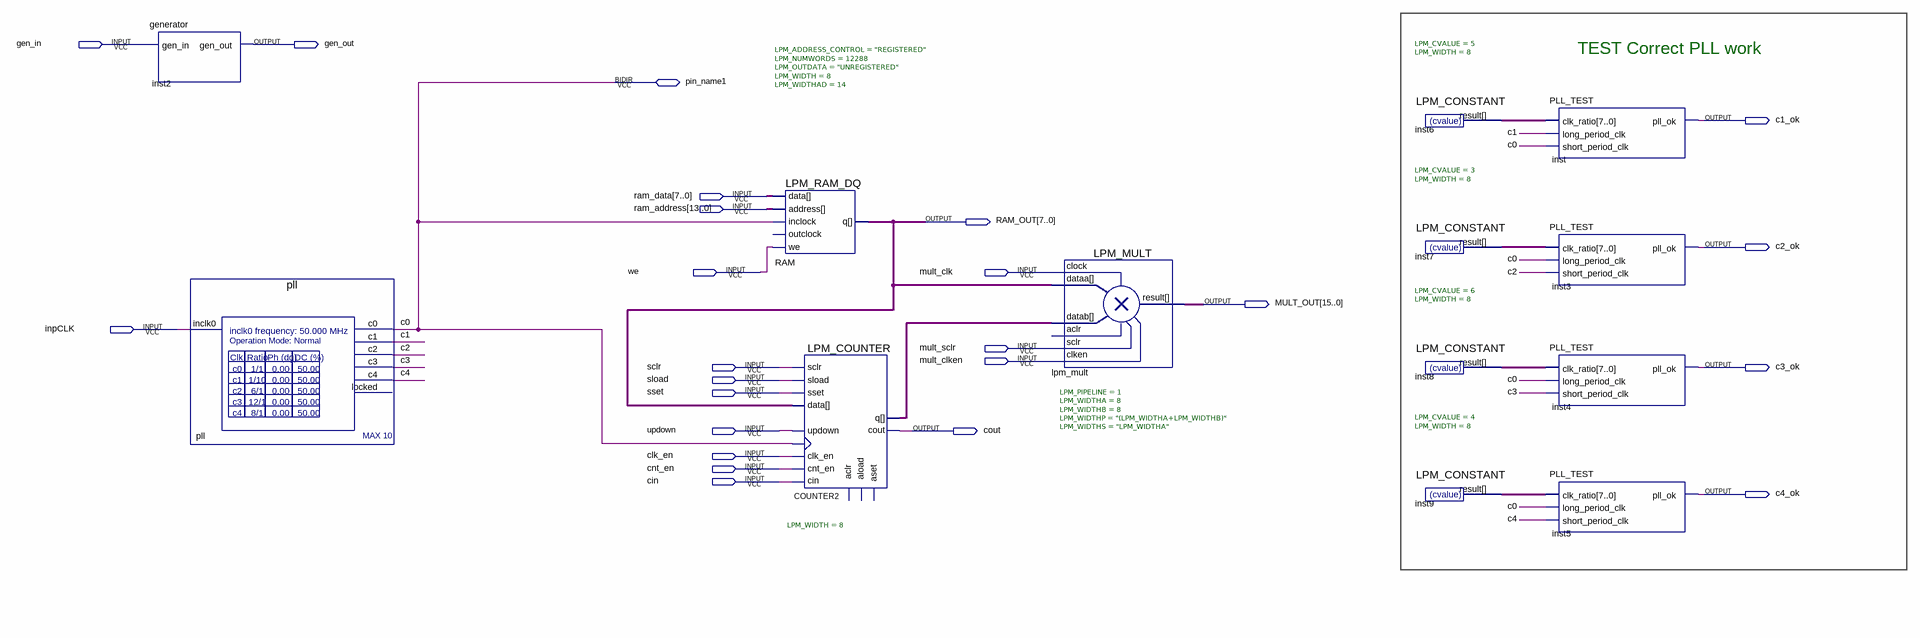
[diagram p0: schematic sheet]
// Quartus schematic main.bdf as structural Verilog: 13 symbols, 24 pins
module main (
  input  gen_in,
  input  [7:0] ram_data,
  input  [13:0] ram_address,
  input  we,
  input  mult_clk,
  input  inpCLK,
  input  mult_sclr,
  input  mult_clken,
  input  sclr,
  input  sload,
  input  sset,
  input  updown,
  input  clk_en,
  input  cnt_en,
  input  cin,
  inout  pin_name1,
  output gen_out,
  output c1_ok,
  output [7:0] RAM_OUT,
  output c2_ok,
  output [15:0] MULT_OUT,
  output c3_ok,
  output cout,
  output c4_ok
);

  wire c1, c2, c3, c4;
  wire [7:0] COUNTER2_q, inst6_result, inst7_result, inst8_result, inst9_result;

  generator inst2 (.gen_in(gen_in), .gen_out(gen_out));
  pll pll (.inclk0(inpCLK), .c0(pin_name1), .c1(c1), .c2(c2), .c3(c3), .c4(c4));  // open: locked
  LPM_RAM_DQ #(.LPM_ADDRESS_CONTROL("REGISTERED"), .LPM_NUMWORDS(12288), .LPM_OUTDATA("UNREGISTERED"), .LPM_WIDTH(8), .LPM_WIDTHAD(14)) RAM (
    .inclock(pin_name1), .data(ram_data), .address(ram_address), .we(we), .q(RAM_OUT));  // open: outclock
  LPM_COUNTER #(.LPM_WIDTH(8)) COUNTER2 (
    .sload(sload), .data(RAM_OUT), .clock(pin_name1), .clk_en(clk_en), .cin(cin), .sset(sset),
    .updown(updown), .cnt_en(cnt_en), .sclr(sclr), .q(COUNTER2_q), .cout(cout));  // open: aload, aclr, aset
  LPM_MULT #(.LPM_PIPELINE(1), .LPM_WIDTHA(8), .LPM_WIDTHB(8), .LPM_WIDTHP("(LPM_WIDTHA+LPM_WIDTHB)"), .LPM_WIDTHS("LPM_WIDTHA")) lpm_mult (
    .clock(mult_clk), .dataa(RAM_OUT), .datab(COUNTER2_q), .sclr(mult_sclr), .clken(mult_clken),
    .result(MULT_OUT));  // open: aclr
  LPM_CONSTANT #(.LPM_CVALUE(5), .LPM_WIDTH(8)) inst6 (.result(inst6_result));
  LPM_CONSTANT #(.LPM_CVALUE(3), .LPM_WIDTH(8)) inst7 (.result(inst7_result));
  LPM_CONSTANT #(.LPM_CVALUE(6), .LPM_WIDTH(8)) inst8 (.result(inst8_result));
  LPM_CONSTANT #(.LPM_CVALUE(4), .LPM_WIDTH(8)) inst9 (.result(inst9_result));
  PLL_TEST inst (.clk_ratio(inst6_result), .long_period_clk(c1), .short_period_clk(pin_name1), .pll_ok(c1_ok));
  PLL_TEST inst3 (.clk_ratio(inst7_result), .long_period_clk(pin_name1), .short_period_clk(c2), .pll_ok(c2_ok));
  PLL_TEST inst4 (.clk_ratio(inst8_result), .long_period_clk(pin_name1), .short_period_clk(c3), .pll_ok(c3_ok));
  PLL_TEST inst5 (.clk_ratio(inst9_result), .long_period_clk(pin_name1), .short_period_clk(c4), .pll_ok(c4_ok));

  // Other names for the same wires on the sheet: c0 = pin_name1

  // Notes on the sheet:
  //   TEST Correct PLL work
endmodule
